# EAGLE design DUBEC (EAGLE 7.7.0)
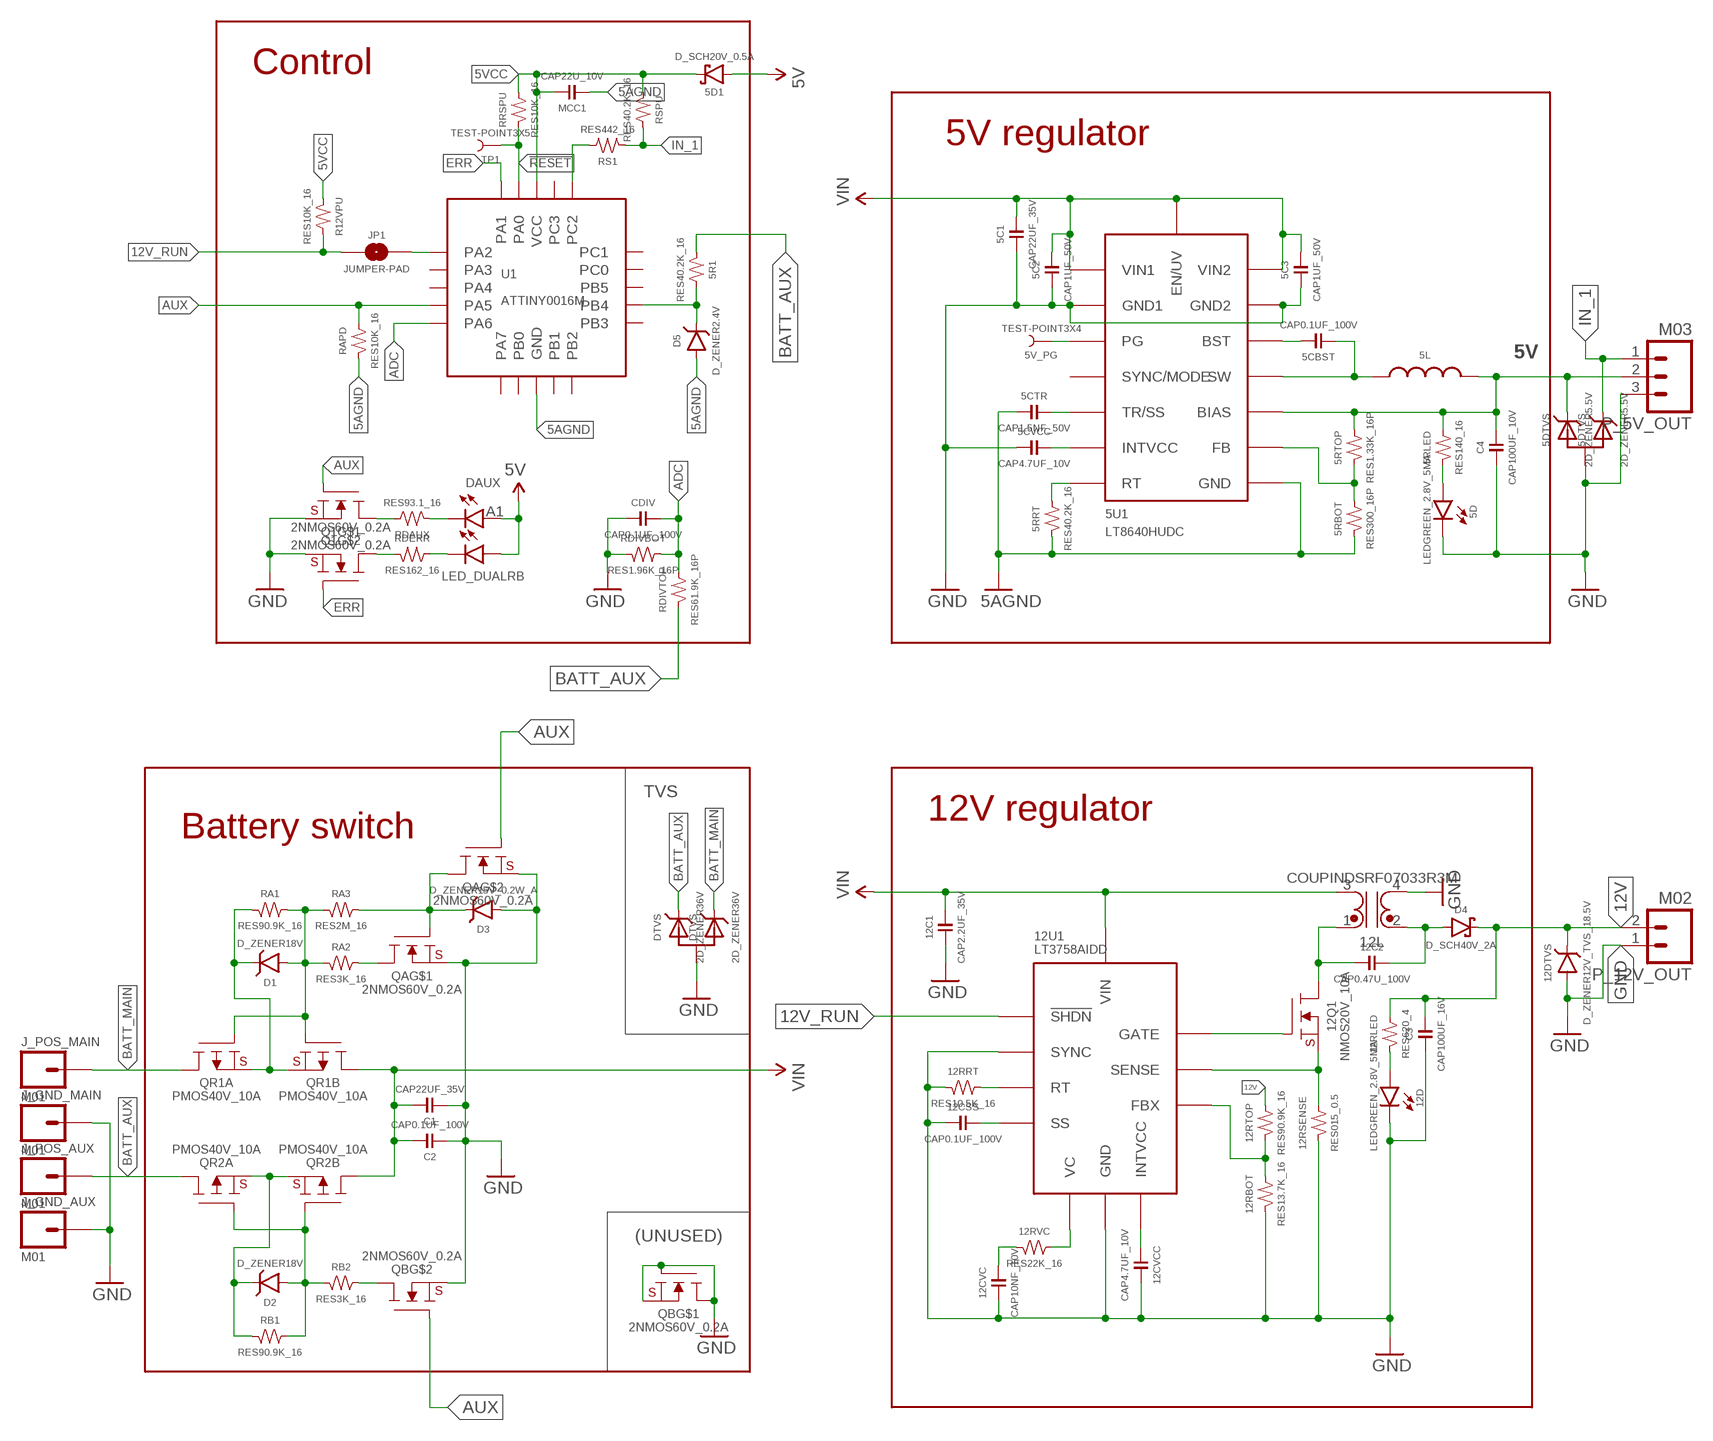
[diagram p0: schematic, sheet 1]

## Parts
5C1  CAP22UF_35V  [0805]
5C2  CAP1UF_50V  [0603]
5C3  CAP1UF_50V  [0603]
5CBST  CAP0.1UF_100V  [0402]
5CTR  CAP1.5NF_50V  [0402]
5CVCC  CAP4.7UF_10V  [0402]
5D  LEDGREEN_2.8V_5MA  [0603+]
5D1  D_SCH20V_0.5A  [SOD523+]
5DTVS  2D_ZENER5.5V  [SOT23-3]
5L  I3.3UH_5A  [SRP5030]
5R1  RES40.2K_16  [0402]
5RBOT  RES300_16P  [0402]
5RLED  RES140_16  [0402]
5RRT  RES40.2K_16  [0402]
5RTOP  RES1.33K_16P  [0402]
5U1  LT8640HUDC  [QFN-18]
5V_PG  TEST-POINT3X4  [PAD.03X.04]
12C1  CAP2.2UF_35V  [0402]
12C2  CAP0.47U_100V  [0805]
12CSS  CAP0.1UF_100V  [0402]
12CVC  CAP10NF_10V  [0402]
12CVCC  CAP4.7UF_10V  [0402]
12D  LEDGREEN_2.8V_5MA  [0603+]
12DTVS  D_ZENER12V_TVS_18.5V  [SOD323+]
12L  COUPINDSRF07033R3M  [SRF0703]
12Q1  NMOS20V_10A  [6-PQFN]
12RBOT  RES13.7K_16  [0402]
12RLED  RES620_4  [0603]
12RRT  RES10.5K_16  [0402]
12RSENSE  RES015_0.5  [1206]
12RTOP  RES90.9K_16  [0402]
12RVC  RES22K_16  [0402]
12U1  LT3758AIDD  [DFN-10]
C1  CAP22UF_35V  [0805]
C2  CAP0.1UF_100V  [0402]
C3  CAP100UF_16V  [1210]
C4  CAP100UF_10V  [1210]
CDIV  CAP0.1UF_100V  [0402]
D1  D_ZENER18V  [SOD523+]
D2  D_ZENER18V  [SOD523+]
D3  D_ZENER15V_0.2W_A  [SOD523+]
D4  D_SCH40V_2A  [DO-214AC]
D5  D_ZENER2.4V  [SOD523+]
DAUX  LED_DUALRB  [0603+DUAL]
DTVS  2D_ZENER36V  [SOT23-3]
J_GND_AUX  M01  [1X01_NO_SILK]
J_GND_MAIN  M01  [1X01_NO_SILK]
J_POS_AUX  M01  [1X01_NO_SILK]
J_POS_MAIN  M01  [1X01_NO_SILK]
JP1  JUMPER-PAD  [JUMPER-PAD-ROUND]
MCC1  CAP22U_10V  [0603]
P_5V_OUT  M03  [1X03_NO_SILK]
P_12V_OUT  M02  [1X02_NO_SILK]
Q1  2NMOS60V_0.2A  [SOT-666]
QA  2NMOS60V_0.2A  [SOT-666]
QB  2NMOS60V_0.2A  [SOT-666]
QR1A  PMOS40V_10A  [POWERDI3333-8]
QR1B  PMOS40V_10A  [POWERDI3333-8]
QR2A  PMOS40V_10A  [POWERDI3333-8]
QR2B  PMOS40V_10A  [POWERDI3333-8]
R12VPU  RES10K_16  [0402]
RA1  RES90.9K_16  [0402]
RA2  RES3K_16  [0402]
RA3  RES2M_16  [0402]
RAPD  RES10K_16  [0402]
RB1  RES90.9K_16  [0402]
RB2  RES3K_16  [0402]
RDAUX  RES93.1_16  [0402]
RDERR  RES162_16  [0402]
RDIVBOT  RES1.96K_16P  [0402]
RDIVTOP  RES61.9K_16P  [0402]
RRSPU  RES10K_16  [0402]
RS1  RES442_16  [0402]
RSPU  RES40.2K_16  [0402]
TP1  TEST-POINT3X5  [PAD.03X.05]
U1  ATTINY0016M  [20-VQFN-2]

## Nets
5AGND: 5CTR.1 5RBOT.1 5RRT.1 5U1.18(GND) D5.A MCC1.1 RAPD.1 U1.3(GND) U1.PAD(GND)
5V: 5D1.A 5DTVS.1(C1) 5L.2 5RLED.2 5RTOP.2 5U1.1(BIAS) C4.2 DAUX.A1 DAUX.A2 P_5V_OUT.2
5V_BST: 5CBST.2 5U1.3(BST)
5V_FB: 5RBOT.2 5RTOP.1 5U1.20(FB)
5V_PG: 5U1.19(PG) 5V_PG.P$1
5V_RT: 5RRT.2 5U1.15(RT)
5V_SW: 5CBST.1 5L.1 5U1.8-9(SW) 5U1.21(SW) 5U1.22(SW)
5V_TR: 5CTR.2 5U1.16(TR/SS)
5V_VCC: 5CVCC.2 5U1.2(INTVCC)
5VCC: 5D1.C MCC1.2 R12VPU.1 RRSPU.2 RSPU.1 U1.4(VCC)
12FBX: 12RBOT.2 12RTOP.1 12U1.2(FBX)
12GATE: 12Q1.G 12U1.7(GATE)
12INTVCC: 12CVCC.1 12U1.8(INTVCC)
12RT: 12RRT.2 12U1.4(RT)
12SENSE: 12Q1.S 12RSENSE.2 12U1.6(SENSE)
12SS: 12CSS.2 12U1.3(SS)
12V: 12DTVS.C 12RLED.2 12RTOP.2 C3.2 D4.C P_12V_OUT.2
12V_RUN: 12U1.9(!SHDN) JP1.1 R12VPU.2
12VC: 12RVC.2 12U1.1(VC)
!RESET: RRSPU.1 TP1.P$1 U1.19(PA0)
ADC: CDIV.2 RDIVBOT.2 RDIVTOP.2 U1.7(PA6)
AUX: Q1.2(G) QA.5(G) QB.5(G) RAPD.2 U1.6(PA5)
BATT_AUX [HV]: 5R1.1 DTVS.1(C1) J_POS_AUX.1 QR2A.D RDIVTOP.1
BATT_MAIN [HV]: DTVS.2(C2) J_POS_MAIN.1 QR1A.D
ERR: Q1.5(G) U1.20(PA1)
GATE_AUX [HV]: D2.A QR2A.G QR2B.G RB1.2 RB2.1
GATE_MAIN [HV]: D1.A QR1A.G QR1B.G RA1.2 RA2.1 RA3.1
GATE_MAIN_B [HV]: D3.C QA.2(G) QA.3(D) RA3.2
GND: 5C1.1 5C2.1 5C3.1 5CVCC.1 5D.C 5DTVS.3(A) 5U1.6(GND1) 5U1.7(GND1) 5U1.10(GND2) 5U1.11(GND2) 12C1.1 12CSS.1 12CVC.1 12CVCC.2 12D.C 12DTVS.A 12L.4(B2) 12RBOT.1 12RRT.1 12RSENSE.1 12U1.5(SYNC) 12U1.PAD(GND) C1.1 C2.1 C3.1 C4.1 CDIV.1 D3.A DTVS.3(A) J_GND_AUX.1 J_GND_MAIN.1 P_5V_OUT.3 P_12V_OUT.1 Q1.1(S) Q1.4(S) QA.1(S) QA.4(S) QB.1(S) QB.2(G) QB.4(S) QB.6(D) RDIVBOT.1
IN_1: 5DTVS.2(C2) P_5V_OUT.1 RS1.1 RSPU.2
LED_BLUE: Q1.6(D) RDAUX.1
LED_RED: Q1.3(D) RDERR.2
N$1: 5R1.2 D5.C U1.10(PB4)
N$5: 5D.A 5RLED.1
N$6: RS1.2 U1.17(PC2)
N$7: 12D.A 12RLED.1
N$8: DAUX.C1 RDAUX.2
N$9 [HV]: QA.6(D) RA2.2
N$10 [HV]: QB.3(D) RB2.2
N$11: DAUX.C2 RDERR.1
N$16: 12CVC.2 12RVC.1
N$20: 12C2.1 12L.1(A1) 12Q1.D
N$21: 12C2.2 12L.2(B1) D4.A
N$22: JP1.2 U1.1(PA2)
SRC_AUX [HV]: D2.C QR2A.S QR2B.S RB1.1
SRC_MAIN [HV]: D1.C QR1A.S QR1B.S RA1.1
VIN [HV]: 5C1.2 5C2.2 5C3.2 5U1.4(VIN1) 5U1.13(VIN2) 5U1.14(EN/UV) 12C1.2 12L.3(A2) 12U1.10(VIN) C1.2 C2.2 QR1B.D QR2B.D
Unconnected: 5U1.17(SYNC/MODE) U1.2(PA3) U1.5(PA4) U1.8(PA7) U1.9(PB5) U1.11(PB3) U1.12(PB2) U1.13(PB1) U1.14(PB0) U1.15(PC0) U1.16(PC1) U1.18(PC3)

## Notes on the sheet
- Control
- 5V regulator
- TVS
- 12V regulator
- Battery switch
- (UNUSED)

## Library data of the parts
5C1 C1 = dubec:CAP: Ceramic capacitor; DIGIKEY_PART_#: 445-14428-1-ND; MANUFACTURER: TDK Corporation; MFG_PART_#: C2012X5R1V226M125AC; TEMP: X5R; TOLERANCE: ±20%; USD: 1.09
5C2 5C3 = dubec:CAP: Ceramic capacitor; DIGIKEY_PART_#: 587-3247-1-ND; MANUFACTURER: Taiyo Yuden; MFG_PART_#: UMK107AB7105KA-T; TEMP: X7R; TOLERANCE: ±10%; USD: 1.71/10
5CBST 12CSS C2 CDIV = dubec:CAP: Ceramic capacitor; DIGIKEY_PART_#: 490-10458-1-ND; MANUFACTURER: Murata Electronics North America; MFG_PART_#: GRM155R62A104KE14D; TEMP: X5R; TOLERANCE: ±10%; USD: 0.65/10
5CTR = dubec:CAP: Ceramic capacitor; DIGIKEY_PART_#: 490-3245-1-ND; MANUFACTURER: Murata Electronics North America; MFG_PART_#: GRM155R71H152KA01D; TEMP: X7R; TOLERANCE: ±10%; USD: 0.97/100
5CVCC 12CVCC = dubec:CAP: Ceramic capacitor; DIGIKEY_PART_#: 445-13820-1-ND; MANUFACTURER: TDK Corporation; MFG_PART_#: C1005X5R1A475K050BC; TEMP: X5R; TOLERANCE: ±10%; USD: 0.43
5D 12D = dubec:LED: LED; DIGIKEY_PART_#: 160-1832-1-ND; MANUFACTURER: Lite-On Inc; MFG_PART_#: LTST-C193TGKT-5A; USD: 0.44; V_FWD: 3V (15mA)
5D1 = dubec:D_SCH: Schottky diode; DIGIKEY_PART_#: NSR0520V2T1GOSCT-ND; EPK: 85.82; MANUFACTURER: ON Semiconductor; MFG_PART_#: NSR0520V2T1G; V_FWD: 480mV @ 500mA
5DTVS = dubec:2D_ZENER; DIGIKEY_PART_#: PACDN042Y3ROSCT-ND; EURO: 14.16/100; MANUFACTURER: ON Semiconductor; MFG_PART_#: PACDN042Y3R
5L = dubec:I: Inductor; DCR: 38 mOhm; DIGIKEY_PART_#: SRP5030TA-3R3MCT-ND; EURO: 1.27; I_SAT: 8A; MANUFACTURER: Bourns Inc.; MFG_PART_#: SRP5030TA-3R3M; TOLERANCE: ±20%
5R1 5RRT RSPU = dubec:RES: Resistor; DIGIKEY_PART_#: 541-40.2KLCT-ND; MANUFACTURER: Vishay Dale; MFG_PART_#: CRCW040240K2FKED; TEMP: ±100ppm/°C; TOLERANCE: ±1%; USD: 2.11/50
5RBOT = dubec:RES: Resistor; DIGIKEY_PART_#: YAG1406CT-ND; EURO: 11.23/100; MANUFACTURER: Yageo; MFG_PART_#: RT0402BRD07300RL; TEMP: ±25ppm/°C; TOLERANCE: ±0.1%
5RLED = dubec:RES: Resistor; DIGIKEY_PART_#: 541-140LCT-ND; EURO: 2.01/50; MANUFACTURER: Vishay Dale; MFG_PART_#: CRCW0402140RFKED; TEMP: ±100ppm/°C; TOLERANCE: ±1%
5RTOP = dubec:RES: Resistor; DIGIKEY_PART_#: YAG1376CT-ND; EURO: 11.49/100; MANUFACTURER: Yageo; MFG_PART_#: RT0402BRD071K33L; TEMP: ±25ppm/°C; TOLERANCE: ±0.1%
5U1 = dubec:LT8640: IC REG BUCK ADJ 5A; DIGIKEY_PART_#: LT8640HUDC#PBF-ND; EURO: 9.70; MANUFACTURER: Linear Technology; MFG_PART_#: LT8640HUDC#PBF
5V_PG TP1 = SparkFun-Passives:TEST-POINT: Bare copper test points for troubleshooting or ICT
12C1 = dubec:CAP: Ceramic capacitor; DIGIKEY_PART_#: 445-9028-1-ND; EURO: 12.88/100; MANUFACTURER: TDK Corporation; MFG_PART_#: C1005X5R1V225K050BC; TEMP: X5R; TOLERANCE: ±10%
12C2 = dubec:CAP: Ceramic capacitor; DIGIKEY_PART_#: 490-3326-1-ND; EURO: 23.92/100; MFG_PART_#: GRM21BR72A474KA73L; TEMP: X7R; TOLERANCE: ±10%
12CVC = dubec:CAP: Ceramic capacitor; DIGIKEY_PART_#: 478-7890-1-ND; MANUFACTURER: AVX Corporation; MFG_PART_#: 0402ZC103KAT2A; TEMP: X7R; TOLERANCE: ±10%; USD: 0.58/100
12DTVS = dubec:D_ZENER: Zener diode; CLAMP: 18.5V / 22.5V; DIGIKEY_PART_#: F6441CT-ND; EURO: 8.00 / 25; MANUFACTURER: Littelfuse Inc.; MFG_PART_#: SD12-01FTG
12L = dubec:COUPIND: Dual-Winding (Coupled) Power Inductor; DIGIKEY_PART_#: SRF0703-3R3MCT-ND; EURO: 7.48/10; IPAR: 3.31A; LPAR: 3.3uH; LSER: 13.2uH; MANUFACTURER: Bourns Inc.; MFG_PART_#: SRF0703-3R3M; RPAR: 31.6mOhms; TOLERANCE: ±20%
12Q1 = dubec:NMOS: N-channel MOSFET; CISS: 1110pF @ 10V; DIGIKEY_PART_#: IRLHS6242TRPBFCT-ND; EURO: 0.48; MFG_PART_#: IRLHS6242TRPBF; POWER: 1.98W (Ta), 9.6W (Tc); QG: 14nC @ 4.5V; RDS: 11.7 mOhm @ 8.5A, 4.5V; VGS: ±12V
12RBOT = dubec:RES: Resistor; DIGIKEY_PART_#: 541-13.7KLCT-ND; EURO: 5.69/1000; MANUFACTURER: Vishay Dale; MFG_PART_#: CRCW040213K7FKED; TEMP: ±100ppm/°C; TOLERANCE: ±1%
12RLED = dubec:RES: Resistor; DIGIKEY_PART_#: P620BYCT-ND; EURO: 3.41/50; MANUFACTURER: Panasonic Electronic Components; MFG_PART_#: ERJ-PA3F6200V; TEMP: ±100ppm/°C; TOLERANCE: ±1%
12RRT = dubec:RES: Resistor; DIGIKEY_PART_#: 541-10.5KLCT-ND; EURO: 5.69/1000; MANUFACTURER: Vishay Dale; MFG_PART_#: CRCW040210K5FKED; TEMP: ±100ppm/°C; TOLERANCE: ±1%
12RSENSE = dubec:RES: Resistor; DIGIKEY_PART_#: CSR1206FK15L0CT-ND; EURO: 3.73/10; MFG_PART_#: CSR1206FK15L0; TOLERANCE: ±1%
12RTOP RA1 RB1 = dubec:RES: Resistor; DIGIKEY_PART_#: 541-90.9KLCT-ND; MANUFACTURER: Vishay Dale; MFG_PART_#: CRCW040290K9FKED; TEMP: ±100ppm/°C; TOLERANCE: ±1%; USD: 0.78/10
12RVC = dubec:RES: Resistor; DIGIKEY_PART_#: 541-22.0KLCT-ND; MANUFACTURER: Vishay Dale; MFG_PART_#: CRCW040222K0FKED; TEMP: ±100ppm/°C; TOLERANCE: ±1%; USD: 2.01/50
12U1 = dubec:LT3758A: High Input Voltage, Boost, Flyback, SEPIC and Inverting Controller; DIGIKEY_PART_#: LT3758AIDD#PBF-ND; MANUFACTURER: Linear Technology; MFG_PART_#: LT3758AIDD#PBF; TEMP: -40°C ~ 125°C (TJ); USD: 90.50/25
C3 = dubec:CAP: Ceramic capacitor; DIGIKEY_PART_#: 587-3152-1-ND; EURO: 13.28/10; MANUFACTURER: Taiyo Yuden; MFG_PART_#: EMK325ABJ107MM-T; TEMP: X5R; TOLERANCE: ±20%
C4 = dubec:CAP: Ceramic capacitor; DIGIKEY_PART_#: 587-1965-1-ND; EURO: 8.45/10; MANUFACTURER: Taiyo Yuden; MFG_PART_#: LMK325BJ107MM-T; TEMP: X5R; TOLERANCE: ±20%
D1 D2 = dubec:D_ZENER: Zener diode; DIGIKEY_PART_#: DZ2S180M0LCT-ND; EURO: 2.44/100; MANUFACTURER: Panasonic Electronic Components; MFG_PART_#: DZ2S180M0L; TOLERANCE: ±5%
D3 = dubec:D_ZENER: Zener diode; DIGIKEY_PART_#: MM5Z15VT1GOSCT-ND; EURO: 4.23/25; MANUFACTURER: ON Semiconductor; MFG_PART_#: MM5Z15VT1G
D4 = dubec:D_SCH: Schottky diode; DIGIKEY_PART_#: 641-1698-1-ND; EURO: 3.93/10; IREV: 1mA @ 40V; MFG_PART_#: CDBA240LL-HF; VFWD: 350mV @ 2A
D5 = dubec:D_ZENER: Zener diode; DIGIKEY_PART_#: BZT585B2V4T-7DICT-ND; EPK: 38.48; IR: 50nA @ 1V; MANUFACTURER: Diodes Incorporated; MFG_PART_#: BZT585B2V4T-7; TEMP: -65°C ~ 150°C; TOLERANCE: ±2%; ZZT: 100 Ohm
DAUX = dubec:LED_DUAL: WARNING: non-standard pin order; DIGIKEY_PART_#: 754-1853-1-ND; EPK: 222.48; IF: 30mA (max); MANUFACTURER: Kingbright; MFG_PART_#: APHB1608QBDSURKC; VF: 3.3V Blue, 1.95V Red
DTVS = dubec:2D_ZENER; DIGIKEY_PART_#: F6350CT-ND; EURO: 4.35/10; MANUFACTURER: Littelfuse Inc.; MFG_PART_#: SM36-02HTG
J_GND_AUX J_GND_MAIN J_POS_AUX J_POS_MAIN = dubec:M01
JP1 = dubec:JUMPER-PAD
MCC1 = dubec:CAP: Ceramic capacitor; DIGIKEY_PART_#: 1276-6504-1-ND; EPK: 51.91; MANUFACTURER: Samsung Electro-Mechanics America, Inc.; MFG_PART_#: CL10A226MPCNUBE; TEMP: X5R; TOLERANCE: ±20%
P_5V_OUT = dubec:M03
P_12V_OUT = dubec:M02
Q1 QA QB = dubec:2NMOS: Dual N-channel MOSFET; DIGIKEY_PART_#: SSM6N7002BFELMCT-ND; EURO: 3.16/10; MANUFACTURER: Toshiba Semiconductor and Storage; MFG_PART_#: SSM6N7002BFE,LM
QR1A QR1B QR2A QR2B = dubec:PMOS: Single P-Channel MOSFET; EURO: 39.10/100; MANUFACTURER: Diodes Incorporated; MFG_PART_#: DMP4013LFG-7; MOUSER_PART_#: 621-DMP4013LFG-7; P: 1 W; RDS: 9.4 mOhms
R12VPU RAPD RRSPU = dubec:RES: Resistor; DIGIKEY_PART_#: 541-10.0KLCT-ND; EPK: 5.24; MANUFACTURER: Vishay Dale; MFG_PART_#: CRCW040210K0FKED; TEMP: ±100ppm/°C; TOLERANCE: ±1%
RA2 RB2 = dubec:RES: Resistor; DIGIKEY_PART_#: 541-3.00KLCT-ND; EURO: 2.10/50; MANUFACTURER: Vishay Dale; MFG_PART_#: CRCW04023K00FKED; TEMP: ±100ppm/°C; TOLERANCE: ±1%
RA3 = dubec:RES: Resistor; DIGIKEY_PART_#: 541-2.00MLCT-ND; EURO: 2.01/50; MANUFACTURER: Vishay Dale; MFG_PART_#: CRCW04022M00FKED; TEMP: ±100ppm/°C; TOLERANCE: ±1%
RDAUX = dubec:RES: Resistor; DIGIKEY_PART_#: 541-93.1LCT-ND; EURO: 2.09/50; MANUFACTURER: Vishay Dale; MFG_PART_#: CRCW040293R1FKED; TEMP: ±100ppm/°C; TOLERANCE: ±1%
RDERR = dubec:RES: Resistor; DIGIKEY_PART_#: 541-162LCT-ND; EPK: 5.24; MANUFACTURER: Vishay Dale; MFG_PART_#: CRCW0402162RFKED; TEMP: ±100ppm/°C; TOLERANCE: ±1%
RDIVBOT = dubec:RES: Resistor; DIGIKEY_PART_#: YAG1385CT-ND; EURO: 11.23/100; MANUFACTURER: Yageo; MFG_PART_#: RT0402BRD071K96L; TEMP: ±25ppm/°C; TOLERANCE: ±0.1%
RDIVTOP = dubec:RES: Resistor; DIGIKEY_PART_#: YAG1462CT-ND; EURO: 11.23/100; MANUFACTURER: Yageo; MFG_PART_#: RT0402BRD0761K9L; TEMP: ±25ppm/°C; TOLERANCE: ±0.1%
RS1 = dubec:RES: Resistor; DIGIKEY_PART_#: 541-442LCT-ND; EURO: 2.10/50; MANUFACTURER: Vishay Dale; MFG_PART_#: CRCW0402442RFKED; TEMP: ±100ppm/°C; TOLERANCE: ±1%
U1 = dubec:ATTINY0016: AVR® 8-bit CPU; DIGIKEY_PART_#: ATTINY1616-MFRCT-ND; EEPROM: 256; EURO: 15.52/25; FLASH: 16KB; MANUFACTURER: Microchip Technology; MFG_PART_#: ATTINY1616-MFR; RAM: 2K; TEMP: -40°C ~ 125°C (TA)

## Net classes
0 default: width 0.2 mm, clearance 0.2 mm
1 ground: width 0.2 mm, clearance 0.2 mm
2 HV: clearance 0.3 mm

## Board
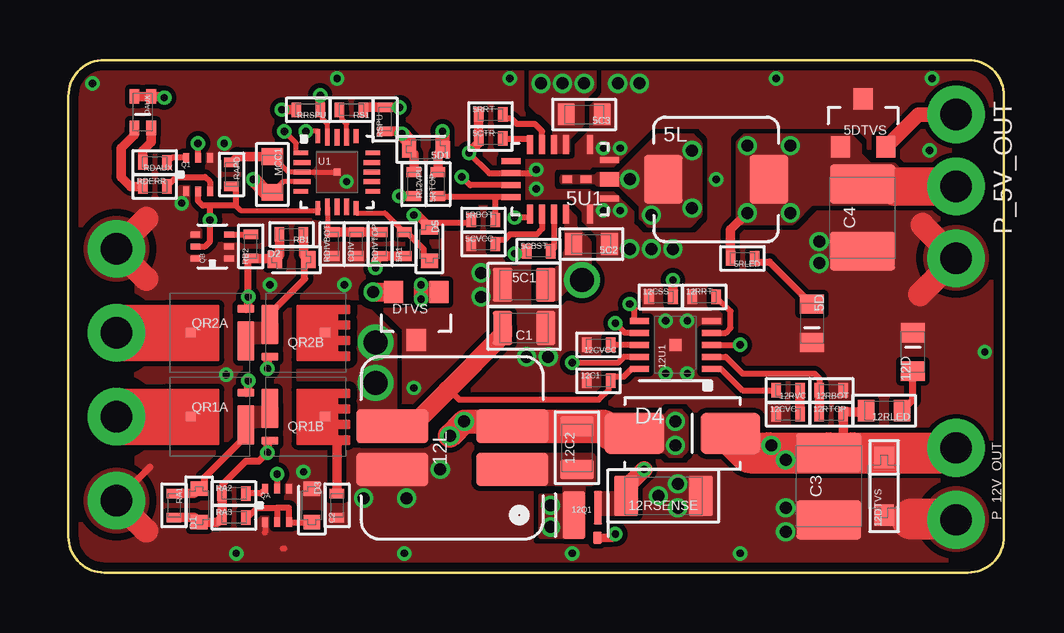
[diagram p1: board, top side]
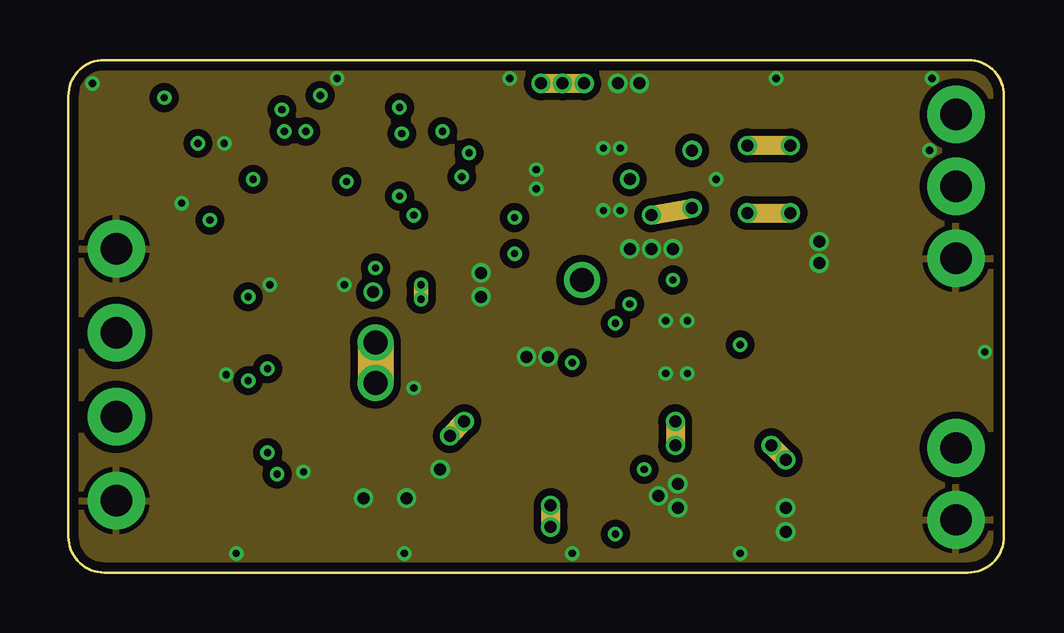
[diagram p2: board, inner layer Route2]
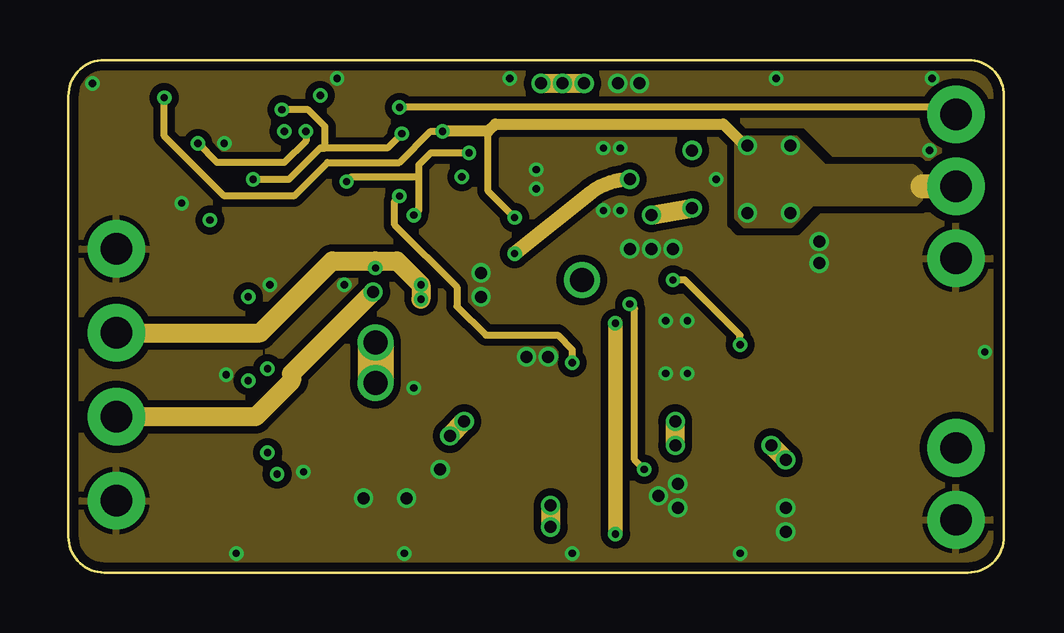
[diagram p3: board, inner layer Route15]
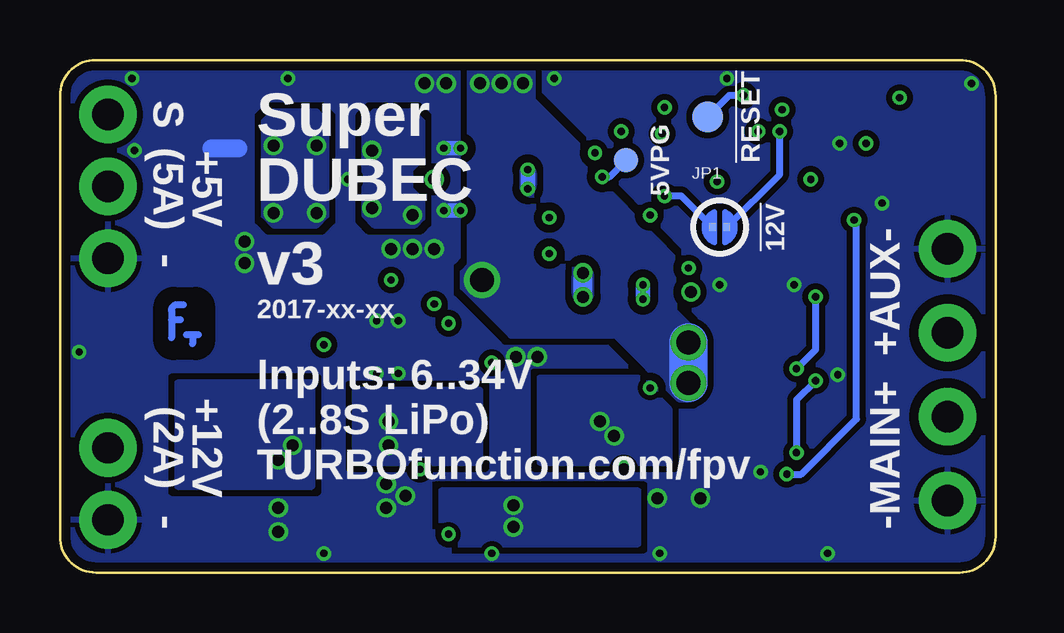
[diagram p4: board, bottom side, seen from below]

Size 39 x 21.38 mm. Coordinates in mm from the lower left corner, seen from the top.
Outline: 0,1.5 arc90 1.5,0 37.5,0 arc90 39,1.5 39,19.88 arc90 37.5,21.38 1.5,21.38 arc90 0,19.88 0,1.5
Copper layers (1+2*15+16): Top 1mil / dielectric 0.2mm / Route2 0.5mil / dielectric 1.2mm / Route15 0.5mil / dielectric 0.2mm / Bottom 1mil
Design rules "OSHPark *": minimum track width 5mil, minimum drill 10mil, track to track 5mil, track to pad 5mil, pad to pad 5mil, via to via 5mil, smd to smd 0mil, copper to edge 15mil, drill to drill 8mil, minimum pad ring 0.15mm, minimum via ring 0.15mm, stop-mask expansion 0.01mm, vias tented up to drill 1.1mm, thermal gap 0.2mm
tRestrict: area 0.5,8.5 to 3.5,11.5; area 0.5,1.5 to 3.5,4.5; area 0.5,12 to 3.5,15; area 0.5,5 to 3.5,8; area 35.5,11.6 to 38.5,14.6; area 35.5,0.7 to 38.5,3.7; 2 lines
bRestrict: area 0.7,5.2 to 3.3,7.8; area 0.7,8.7 to 3.3,11.3
vRestrict: 3 lines

### Footprints (pad centres in the part's own frame; a part is rotated, then mirrored left to right if it is on the bottom)
0805 = smd 0.8 x 1.4: 1 -0.9,0; 2 0.9,0
0603 = smd 0.7 x 0.9: 1 -0.75,0; 2 0.75,0
0402 = smd 0.4 x 0.6: 1 -0.5,0; 2 0.5,0
0603+ = smd 0.8 x 1: A -0.8,0; C 0.8,0
SOD523+ = smd 0.6 x 0.7: A -0.7,0; C 0.7,0
SOT23-3 = smd 0.8 x 0.9: 1 0.95,1; 2 -0.95,1; 3 0,-1
SRP5030 = smd 1.6 x 2: 1 -2.2,0; 2 2.2,0
QFN-18 = smd 0.25 x 0.8: 1 1.25,1.45; 2 0.75,1.45; 3 0.25,1.45; 4 -0.25,1.45; 6 -1.25,1.45; 11 -1.25,-1.45; 13 -0.25,-1.45; 14 0.25,-1.45; 15 0.75,-1.45; 16 1.25,-1.45 | smd 0.8 x 0.25: 7 -2.05,0.8; 10 -2.05,-0.8; 17 2.05,-0.75; 18 2.05,-0.25; 19 2.05,0.25; 20 2.05,0.75 | smd 0.8 x 0.6: 8-9 -2.05,0 | smd 0.45 x 0.3: 21 -1.075,0 | smd 0.4 x 0.3: 22 -0.3,0
PAD.03X.04 = smd 1.016 x 1.016: P$1 0,0
SOD323+ = smd 0.9 x 0.8: A -1.2,0; C 1.2,0
SRF0703 = smd 1.4 x 3: 1 -0.9,-2.5; 2 0.9,-2.5; 3 0.9,2.5; 4 -0.9,2.5
6-PQFN = smd 0.95 x 2: D -0.325,0 | smd 0.35 x 0.5: G 0.65,-0.95 | smd 0.35 x 1.4: S 0.675,0.3
1206 = smd 1 x 1.7: 1 -1.55,0; 2 1.55,0
DFN-10 = smd 0.25 x 0.8: 1 -1,-1.5; 2 -0.5,-1.5; 3 0,-1.5; 4 0.5,-1.5; 5 1,-1.5; 6 1,1.5; 7 0.5,1.5; 8 0,1.5; 9 -0.5,1.5; 10 -1,1.5 | smd 0.5 x 0.5: PAD 0,0
1210 = smd 1.6 x 2.7: 1 -1.4,0; 2 1.4,0
DO-214AC = smd 2.5 x 1.7: A -2,0; C 2,0
0603+DUAL = smd 0.6 x 0.4: A1 -0.65,0.35; A2 -0.65,-0.35; C1 0.65,0.35; C2 0.65,-0.35
1X01_NO_SILK = drill 1.3 pad 2.4: 1 0,0
JUMPER-PAD-ROUND = smd 0.3 x 0.4: 1 -0.3,0; 2 0.3,0
1X03_NO_SILK = drill 1.3 pad 2.4: 1 -3,0; 2 0,0; 3 3,0
1X02_NO_SILK = drill 1.3 pad 2.4: 1 -1.5,0; 2 1.5,0
SOT-666 = smd 0.25 x 0.4: 1 -0.5,-0.7; 2 0,-0.7; 3 0.5,-0.7; 4 0.5,0.7; 5 0,0.7; 6 -0.5,0.7
POWERDI3333-8 = smd 0.4 x 0.4: D -0.8,0 | smd 0.7 x 0.35: G 1.5,1 | smd 0.7 x 1.65: S 1.5,-0.35
PAD.03X.05 = smd 1.27 x 1.27: P$1 0,0
20-VQFN-2 = smd 0.6 x 0.2: 1 -1.5,0.8; 5 -1.5,-0.8; 11 1.5,-0.8; 15 1.5,0.8 | smd 0.7 x 0.2: 2 -1.45,0.4; 3 -1.45,0; 4 -1.45,-0.4; 12 1.45,-0.4; 13 1.45,0; 14 1.45,0.4 | smd 0.2 x 0.6: 6 -0.8,-1.5; 10 0.8,-1.5; 16 0.8,1.5; 20 -0.8,1.5 | smd 0.2 x 0.7: 7 -0.4,-1.45; 8 0,-1.45; 9 0.4,-1.45; 17 0.4,1.45; 18 0,1.45; 19 -0.4,1.45 | smd 0.3 x 0.3: PAD 0,0

### Placement (x,y rotation side)
5C1  19,12 0 top
5C2  21.8,13.7 180 top
5C3  21.5,19.1 180 top
5CBST  19.6,13.4 0 top
5CTR  17.6,18.1 0 top
5CVCC  17.3,13.7 0 top
5D  31,10.4 270 top
5D1  14.9,17.65 180 top
5DTVS  33.12,18.75 180 top
5L  27,16.4 0 top
5R1  14,13.7 90 top
5RBOT  17.3,14.7 0 top
5RLED  28.1,13.1 180 top
5RRT  17.6,19.1 0 top
5RTOP  15.4,16.2 90 top
5U1  20.5,16.4 180 top
5V_PG  15.4,17.2 0 bottom
12C1  22.1,8 0 top
12C2  21.2,5.2 90 top
12CSS  24.7,11.5 0 top
12CVC  30,6.6 0 top
12CVCC  22.1,9.5 180 top
12D  35.2,9.2 90 top
12DTVS  34,3.6 90 top
12L  16,5.2 90 top
12Q1  21.4,2.4 0 top
12RBOT  31.8,7.6 180 top
12RLED  34,6.75 180 top
12RRT  26.5,11.5 0 top
12RSENSE  24.8,3.2 180 top
12RTOP  31.8,6.6 0 top
12RVC  30,7.6 180 top
12U1  25.3,9.5 90 top
C1  19,10.2 180 top
C2  11.2,2.8 90 top
C3  31.7,3.6 90 top
C4  33.1,14.8 90 top
CDIV  12,13.7 90 top
D1  5.45,2.8 90 top
D2  9.3,13.05 0 top
D3  10.15,2.8 270 top
D4  25.6,5.8 0 top
D5  15.05,13.7 270 top
DAUX  3.1,19.2 270 top
DTVS  14.5,10.7 0 top
J_GND_AUX  2,3 0 top
J_GND_MAIN  2,13.5 0 top
J_POS_AUX  2,10 0 top
J_POS_MAIN  2,6.5 0 top
JP1  11.5,14.4 0 bottom
MCC1  8.5,16.6 270 top
P_5V_OUT  37,16.1 270 top
P_12V_OUT  37,3.7 90 top
Q1  5.4,16.6 0 top
QA  8.7,2.8 0 top
QB  6,13.6 90 top
QR1A  5.9,6.5 0 top
QR1B  9.9,6.5 180 top
QR2A  5.9,10 0 top
QR2B  9.9,10 180 top
R12VPU  14.4,16.2 270 top
RA1  4.4,2.8 270 top
RA2  6.9,3.3 0 top
RA3  6.9,2.3 0 top
RAPD  6.8,16.6 270 top
RB1  9.3,14.1 180 top
RB2  7.6,13.6 90 top
RDAUX  3.6,17.1 180 top
RDERR  3.6,16.1 0 top
RDIVBOT  11,13.7 90 top
RDIVTOP  13,13.7 90 top
RRSPU  10,19.3 180 top
RS1  11.8,19.3 180 top
RSPU  13.2,18.9 90 top
TP1  12,19 0 bottom
U1  11.2,16.7 0 top
U$1  [TF-EMBLEM]  33.8,10.4 0 bottom

### Tracks (layer width: path | path; a pad name or v marks a point on that pad's centre or on a via)
5AGND  (via drill 0.3)
  Top 0.2: U1.PAD U1.3 9.15,16.7 MCC1.1
  Top 0.25: 5U1.18 17.55,16.65 v16.7,17.5 | 5RBOT.1 16.68,14.57 15.22,14.57 D5.A
  Top 0.4: 5RRT.1 5CTR.1 17.1,17.9 v16.7,17.5 | RAPD.1 7.05,17.35 MCC1.1 | D5.A 14.55,14.9 v14.4,14.9
  Route15 0.3: v16.7,17.5 15.1,17.5 14.6,17 14.6,16.5 | 14.6,16.5 11.8,16.5 v11.6,16.3 | 14.6,16.5 14.6,15.1 v14.4,14.9
  pour Top (no thermals): 10.2,17.5 12,17.5 12,15.9 10.2,15.9
5V  (via drill 0.3, 0.5)
  Top 0.25: 5U1.1 19.25,14.8 v18.6,14.8
  Top 0.4: DAUX.A2 DAUX.A1 3.95,19.85 v4,19.8 | 5RLED.2 27.6,14.3 v28.3,15 | 5RTOP.2 15.4,17.45 5D1.A
  Top 0.6: v15.6,18.4 5D1.A
  Top 1.6: P_5V_OUT.2 34.5,16.1
  Route2 0.8: v28.3,15 v30.1,15 | v30.1,17.8 v28.3,17.8
  Route15 0.3: v4,19.8 4,18.2 6.5,15.7 9.4,15.7 10.8,17.1 13.8,17.1 15.1,18.4 v15.6,18.4 | v18.6,14.8 17.5,15.9 17.5,18.4
  Route15 0.45: 28.1,17.9 27.3,18.7 17.8,18.7 17.5,18.4 v15.6,18.4
  Route15 1: P_5V_OUT.2 35.6,16.1
  pour Top (rank 4, no thermals): 27.9,17.9 27.9,14.6 30.2,14.6 31,15.4 34.6,15.4 34.6,16.8 34.4,17 33.4,17 33,17.4 33,17.8 32.6,18.2 28.2,18.2
  pour Route15 (isolate 0.33, rank 2): 27.9,14.8 27.9,18.1 30.3,18.1 31.5,16.9 35.2,16.9 35.7,16.4 35.7,15.8 35.3,15.4 31,15.4 30.1,14.5 28.2,14.5
  pour Bottom: 27.9,14.9 27.9,18.8 28.3,19.2 30.1,19.2 30.5,18.8 30.5,14.9 30.1,14.5 28.3,14.5
5V_BST
  Top 0.25: 5U1.3 20.25,13.55 5CBST.2
5V_FB
  Top 0.25: 5U1.20 17.8,15.65 | 17.8,15.65 15.45,15.65 5RTOP.1 | 5RBOT.2 17.8,15.65
5V_PG  (via drill 0.3)
  Top 0.25: 5U1.19 16.75,16.15 v16.4,16.5
  Bottom 0.3: v16.4,16.5 16.1,16.5 5V_PG.P$1
5V_RT
  Top 0.25: 5U1.15 19.75,18.4 19.45,18.7 18.7,18.7 18.48,18.93 18.27,18.93 5RRT.2
5V_SW  (via drill 0.3, 0.5)
  Top 0.4: v18.6,13.3 19,13.3 5CBST.1
  Route2 0.8: v24.3,14.9 v26,15.2
  Route15 0.6: v18.6,13.3 21.77,15.85 arc-25 23,16.38 v23.4,16.4
  Route15 0.8: v24.3,14.9 v26,15.2
  other vias: 26,17.6
  pour Bottom (isolate 0.33, rank 2): 24.3,19.2 25.9,19.2 26.3,18.8 26.3,14.9 25.9,14.5 24.2,14.5 23.9,14.8 23.9,15.5 24.4,16 24.4,16.8 23.9,17.3 23.9,18.8
  pour Top (no thermals): 20.6,16.3 20.6,16.5 22,16.5 22.1,16.6 23,16.6 24.6,18.2 26,18.2 26.3,17.9 26.3,14.9 25.9,14.5 24.2,14.5 23.9,14.8 23.9,15.3 23,16.2 22.1,16.2 22,16.3
5V_TR
  Top 0.25: 5CTR.2 19.25,18.1 5U1.16
5V_VCC
  Top 0.25: 5U1.2 19.75,14.32 19.52,14.1 18.4,14.1 18.18,13.88 17.98,13.88 5CVCC.2
5VCC  (via drill 0.3)
  Top 0.2: U1.4 8.95,16.3 MCC1.2
  Top 0.4: v8.9,19.3 RRSPU.2 | RSPU.1 13.8,18.4 v13.9,18.3 | R12VPU.1 14.4,17.45 5D1.C
  Top 0.6: v7.7,16.4 8.25,15.85 MCC1.2 | 5D1.C 14.2,18 v13.9,18.3
  Route15 0.3: v13.9,18.3 13.3,17.7 10.7,17.7 | 10.7,17.7 10.5,17.7 9.2,16.4 v7.7,16.4 | 10.7,17.7 10.7,18.6 10,19.3 v8.9,19.3
12FBX
  Top 0.25: 12U1.2 27.4,9 28.1,8.3 31.1,8.3 31.3,8.1 12RBOT.2
  Top 0.4: 12RBOT.2 12RTOP.1
12GATE  (via drill 0.3)
  Top 0.25: 12U1.7 23.2,10 v22.8,10.4
  Top 0.35: 12Q1.G 22.65,1.45 v22.8,1.6
  Route15 0.6: v22.8,1.6 v22.8,10.4
12INTVCC
  Top 0.25: 12U1.8 12CVCC.1
12RT
  Top 0.25: 12U1.4 27.4,10 27.6,10.2 27.6,10.9 12RRT.2
12SENSE  (via drill 0.3)
  Top 0.25: 12U1.6 23.6,10.5 23.6,11 v23.4,11.2
  Top 0.7: v24,4.3 23.25,3.55 12RSENSE.2
  Route15 0.3: v24,4.3 23.6,4.7 23.6,11 v23.4,11.2
  pour Top: 22.15,2.4 22.85,2.4 22.85,3.35 22.15,3.35
12SS  (via drill 0.3)
  Top 0.25: 12U1.3 v28,9.5
  Top 0.4: 12CSS.2 v25.2,12.2
  Route15 0.3: v28,9.5 28,9.9 25.7,12.2 v25.2,12.2
12V  (via drill 0.5)
  Top 0.4: 12RLED.2 33.2,6.7 32.4,6.7 12RTOP.2 32.3,5.6 C3.2 | v29.9,4.7 v29.3,5.3 29.2,5 | 12DTVS.C 32.9,4.8 32.7,5
  Top 1.7: D4.C 28.4,5 29.2,5 C3.2 32.7,5 36.8,5 P_12V_OUT.2
  Route2 0.8: v29.3,5.3 v29.9,4.7
  Route15 0.8: v29.3,5.3 v29.9,4.7
  pour Bottom (no thermals): 28.5,3.6 28.5,7.9 34.1,7.9 34.1,3.6
12V_RUN  (via drill 0.3)
  Top 0.25: 12U1.9 23.15,9 22.9,8.75 v21,8.75
  Top 0.4: R12VPU.2 v13.8,15.7
  Route15 0.3: v13.8,15.7 13.6,15.5 13.6,14.5 16.2,11.9 16.2,11.1 17.4,9.9 20.4,9.9 21,9.3 v21,8.75
  Bottom 0.3: JP1.1 13.1,15.7 v13.8,15.7
12VC
  Top 0.25: 12U1.1 27.2,8.5 28.1,7.6 12RVC.2
!RESET  (via drill 0.3)
  Top 0.2: U1.19 10.8,18.7 10.6,18.9 10.6,19.2 RRSPU.1
  Top 0.4: RRSPU.1 v10.5,19.9
  Bottom 0.3: TP1.P$1 11.1,19.9 v10.5,19.9
ADC
  Top 0.2: U1.7 10.8,14.4 RDIVBOT.2
  Top 0.4: RDIVBOT.2 CDIV.2 RDIVTOP.2
AUX  (via drill 0.3)
  Top 0.2: U1.6 10.4,15.1 | 10.4,15 10.4,15.1 | 10.4,15.1 7.17,15.1 6.97,15.3
  Top 0.25: 5.9,15.3 6.97,15.3 6.97,15.93 RAPD.2 | 5.9,15.3 5.6,15.3 5.4,15.5 Q1.2 | v8.7,4.1 QA.5 | QB.5 5.7,13.6 5.9,13.8 v5.9,14.7 5.9,15.3
  Bottom 0.3: v8.7,4.1 8.1,4.1 5.8,6.4 5.8,14.6 v5.9,14.7
BATT_AUX  (via drill 0.3)
  Top 0.4: 5R1.1 RDIVTOP.1 12.8,13 v12.8,12.7
  Top 0.6: v14.7,12 v14.7,11.4
  Top 2.35: J_POS_AUX.1 QR2A.D
  Route2 0.6: v14.7,12 v14.7,11.4
  Route15 0.3: v12.8,12.7 12.8,13
  Route15 0.8: J_POS_AUX.1 8,10 11,13 12.8,13 13.7,13 v14.7,12 v14.7,11.4
  Bottom 0.6: v14.7,12 v14.7,11.4
  pour Top (no thermals): 15.47,11.35 14.7,11.35 14.7,12.05 15.47,12.05
BATT_MAIN  (via drill 0.5)
  Top 0.8: v12.7,11.7 DTVS.2
  Top 2.35: J_POS_MAIN.1 QR1A.D
  Route15 0.8: v12.7,11.7 9.3,8.3 9.3,8 7.8,6.5 J_POS_MAIN.1
ERR  (via drill 0.3)
  Top 0.2: U1.20 10.4,18.4 v9.9,18.4
  Top 0.25: Q1.5 v5.4,17.9
  Route15 0.3: v9.9,18.4 9.9,18 9,17.1 6.2,17.1 v5.4,17.9
GATE_AUX  (via drill 0.3)
  Top 0.3: v7.5,11.5 7.5,13.1 RB2.1
  Top 0.35: v8.3,8.5 8.3,8.9 QR2B.G | v7.5,11.5 7.5,11.1 QR2A.G
  Top 0.4: RB2.1 8.55,13.1 D2.A 8.8,13.25 RB1.2
  Bottom 0.3: v8.3,8.5 7.5,9.3 v7.5,11.5
GATE_MAIN  (via drill 0.3)
  Top 0.3: RA2.1 6.45,3.35 6.45,3.7 7.4,4.65 7.95,4.65 v8.3,5
  Top 0.35: 6.38,3.33 RA2.1 | v7.5,8 7.5,7.6 QR1A.G | v8.3,5 8.3,5.4 QR1B.G
  Top 0.4: RA2.1 RA3.1 6.2,2.1 D1.A 5.25,2.3 RA1.2
  Bottom 0.3: v7.5,8 8.3,7.2 v8.3,5
GATE_MAIN_B
  Top 0.25: RA3.2 7.47,2.3 7.88,2.7 8.7,2.7 | 8.7,2.7 QA.2 | 8.7,2.7 9.2,2.7 QA.3 D3.C
GND  (via drill 0.3, 0.5)
  Top 0.25: 18.6,16.65 19.3,16.65 | 9,1 8.94,1 | QA.1 8.2,1.68
  Top 0.3: J_GND_AUX.1 3.4,4.4
  Top 1: 3.25,1.75 J_GND_AUX.1 | 3.25,14.75 J_GND_MAIN.1 3.25,12.25 | 35.5,11.6 P_5V_OUT.3 35.6,14.5
  Top 1.7: 37,2.23 35.15,2.23
  Bottom 0.6: v22.3,17.7 v23,17.7 | v19.5,16.8 v19.5,16 | v22.3,15.1 v23,15.1
  Bottom 0.75: 31.56,17.69 32.69,17.69
  Bottom 0.8: v17.2,11.5 v17.2,12.5
  other vias: 22.9,20.4 25.2,13.5 36,20.6 21,0.8 7,0.8 27,16.4 23.8,20.4 11.2,20.6 6.5,17.9 1,20.4 18.4,20.6 24.3,13.5 35.9,17.6 23.4,13.5 38.2,9.2 31.3,13.8 28,0.8 31.3,12.9 29.5,20.6 11.5,12 25.4,3.7 25.4,2.7 24.6,3.2 15.5,4.3 14.1,3.1 29.9,2.7 29.9,1.7 24.9,8.3 25.8,8.3 25.8,10.5 24.9,10.5 4.72,15.4 14,0.8 6.58,8.25 8.4,12 9.8,4.2 12.3,3.1 19.1,9 20,9 14.4,7.7
  pour Route2 (isolate 0.3): 0,22.5 40,22.5 40,0 0,0
  pour Top (rank 5, no thermals): 0,0 0,22 39.5,22 39.5,0
  pour Bottom (isolate 0.25, rank 5): 0,23.5 41,23.5 41,0 0,0
  pour Route15 (isolate 0.3, rank 5): 0,23 40.5,23 40.5,0 0,0
IN_1  (via drill 0.3)
  Top 0.4: RS1.1 12.4,19.4 RSPU.2 v13.8,19.4
  Top 0.6: 5DTVS.2 35.42,19.1 P_5V_OUT.1
  Route15 0.3: v13.8,19.4 36.7,19.4 P_5V_OUT.1
LED_BLUE
  Top 0.25: Q1.6 4.3,17.3 RDAUX.1
LED_RED
  Top 0.25: Q1.3 5.9,16.3 5.7,16.5 4.5,16.5 RDERR.2
N$1
  Top 0.2: U1.10 12,15 13.2,15 5R1.2
  Top 0.25: D5.C 14.82,13.22 14.82,13.47 14.1,14.2 5R1.2
N$5
  Top 0.3: 5RLED.1 28.75,12.95 29.23,12.95 30.98,11.2 5D.A
N$6
  Top 0.2: U1.17 11.6,18.7 11.4,18.9 11.4,19.2 RS1.2
N$7
  Top 0.3: 12RLED.1 35.2,7.2 12D.A
N$8
  Top 0.4: RDAUX.2 3.1,17.6 3.45,17.95 DAUX.C1
N$9
  Top 0.25: QA.6 8,3.3 RA2.2
N$10
  Top 0.25: QB.3 RB2.2
N$11
  Top 0.4: RDERR.1 2.6,16.1 2.2,16.5 2.2,17.7 2.75,18.25 DAUX.C2
N$16
  Top 0.4: 12RVC.1 12CVC.2
N$20  (via drill 0.5)
  Route2 0.8: v20.1,2.8 v20.1,1.9
  Route15 0.8: v20.1,2.8 v20.1,1.9
  pour Top (no thermals): 19.9,4.8 21.8,4.8 21.8,3.8 19.9,3.8
  pour Top (no thermals): 20.7,3.3 20.7,3.8 21.45,3.8 21.45,3.3
  pour Top (no thermals): 20.8,1.5 19.7,1.5 19.7,3.2 20.8,3.2
  pour Bottom: 14.9,3.4 23.1,3.4 23.1,1.2 14.9,1.2
N$21  (via drill 0.5)
  Top 1: v15.9,5.7 v16.5,6.3 18.3,6.3 12L.2
  Top 1.4: 12L.2 12C2.2 22.3,6.1 22.6,5.8 D4.A
  Route2 0.8: v15.9,5.7 v16.5,6.3 | v25.3,6.3 v25.3,5.3
  Route15 0.8: v15.9,5.7 v16.5,6.3 | v25.3,5.3 v25.3,6.3
  pour Top (no thermals): 24.2,6.5 24.9,6.5 25.1,6.7 25.5,6.7 25.7,6.5 25.7,5.1 25.5,4.9 25.1,4.9 24.9,5.1 24.2,5.1
  pour Bottom (rank 2, no thermals): 14.9,8.1 19,8.1 19,4.6 13.6,4.6 13.6,6.8
  pour Bottom (no thermals): 21.5,7.6 26.7,7.6 26.7,4.6 21.5,4.6
N$22  (via drill 0.3)
  Top 0.2: U1.1 9.5,17.5 9.5,17.9 v9,18.4
  Bottom 0.3: JP1.2 9,16.6 v9,18.4
SRC_AUX
  Top 0.3: QR2B.S 8.4,10.8 9.85,12.25 9.85,12.9 D2.C
  Top 0.4: RB1.1 9.8,13.25 D2.C
  pour Top (no thermals): 8.65,9.62 7.15,9.62 7.15,10.38 8.65,10.38
SRC_MAIN
  Top 0.3: 5.4,3.55 D1.C 5.65,3.7 5.65,3.95 7.4,5.7 QR1A.S
  Top 0.4: RA1.1 5.25,3.3 D1.C
  pour Top (no thermals): 8.65,6.12 7.15,6.12 7.15,6.88 8.65,6.88
VIN  (via drill 0.5, 1)
  Top 0.25: 12U1.10 23.48,8.5 23.15,8.18 22.77,8.18 12C1.2 22.52,7.92 22.52,7.62 22.1,7.2 16.3,7.2 15.9,7.6 15.8,7.6
  Top 0.4: C2.2 11.2,5.5
  Top 0.8: C1.2 18.1,9.9 15.8,7.6 14.3,6.1 12L.3
  Route2 0.8: v21.5,20.4 v20.6,20.4 v19.7,20.4
  Route2 1.5: v12.8,9.6 v12.8,7.9
  Route15 0.8: v21.5,20.4 v20.6,20.4 v19.7,20.4
  Route15 1.5: v12.8,9.6 v12.8,7.9
  Bottom 1.6: v12.8,9.6 v12.8,7.9
  other vias: 21.4,12.2
  pour Top (isolate 0.305, no thermals): 19.6,11.4 19.6,12.6 20.3,12.6 20.7,13 20.7,15.2 21.1,14.8 21.1,14.4 21.7,13.8 21.7,12.8 20.3,11.4
  pour Top (isolate 0.305, no thermals): 20.2,17.55 20.2,18.6 19.3,19.5 19.3,21.2 21.9,21.2 21.9,20.2 21.4,19.7 21.4,18.7 20.8,18.1 20.8,17.55
  pour Bottom (isolate 0.33, no thermals): 19.3,21.4 21.9,21.4 21.9,12.8 22.2,12.5 22.2,11.9 20.2,9.9 15.85,9.9 13.2,7.25 12.8,7.25 12.8,10.3 13.4,10.9 13.4,13.1 17.4,17.2 17.4,17.8 19.3,19.7
  pour Top (no thermals): 9.55,11.12 12.45,11.12 13.65,9.93 13.65,5.45 9.55,5.45

### Text on the board
bPlace: Super / DUBEC | !RESET | S | 5VPG | +5V / (5A) | !12V | - | +AUX- | v3 | 2017-xx-xx | Inputs: 6..34V / (2..8S LiPo) / TURBOfunction.com/fpv | -MAIN+ | +12V / (2A) | -
tLabels: AUX | 5V | 12V